# Altium schematic sheet EgSA-Cube3.SchDoc (part 2 of 3)
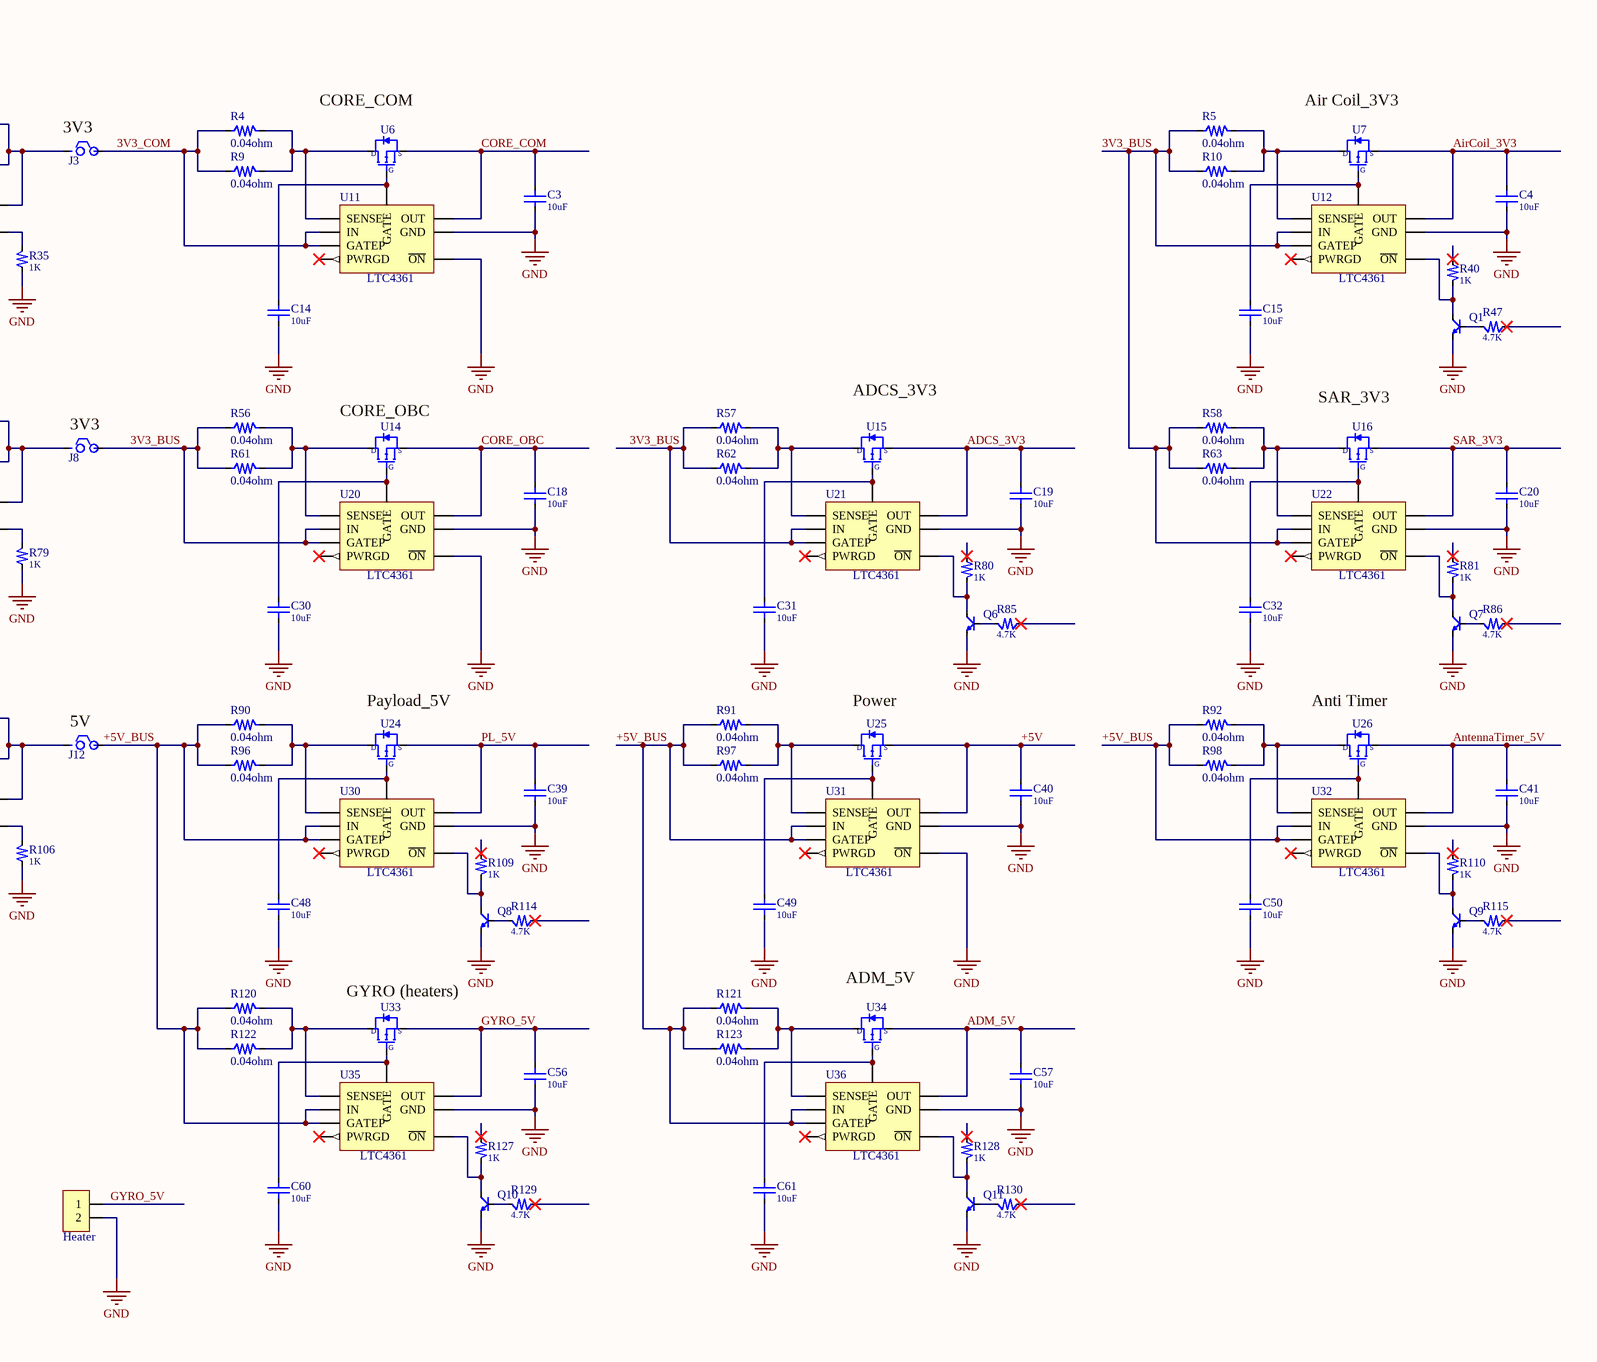
[diagram p4: EgSA-Cube3.SchDoc, bottom right]
## Library data of the parts
+X +Y +Z -X -Y Heater J_BAT J_SAR RBF1 RBF2 SSW1 = 53261-0271: CONN HEADER SMD R/A 2POS 1.25MM; Manufacturer: Molex, LLC; Manufacturer Part Number: 0532610271; Pitch - Mating: 0.049" (1.25mm); Number of Positions: 2; Number of Positions Loaded: All; Style: Board to Cable/Wire; Shrouding: Shrouded - 4 Wall; Material Flammability Rating: UL94 V-0; Mated Stacking Heights: 3.4mm; Supplier 1: Digi-Key; RoHS: RoHS Compliant; Category: Connectors, Interconnects; Stock 1: 17574; Pricing 1: 1=0.93, 10=0.819, 100=0.7066, 500=0.57816 (USD); Packaging: Cut Tape (CT); Part Status: Active; Connector Type: Header; Contact Type: Male Blade; Number of Rows: 1; Row Spacing - Mating: -; Mounting Type: Surface Mount, Right Angle; Termination: Solder; Fastening Type: Detent Lock; Contact Length - Mating: -; Contact Length - Post: -; Overall Contact Length: -; Insulation Height: 0.134" (3.40mm); Contact Shape: Rectangular; Contact Finish - Mating: Tin; Contact Finish Thickness - Mating: 39µin (1.00µm); Contact Finish - Post: Tin; Contact Material: Phosphor Bronze; Insulation Material: Polyamide (PA46), Nylon 4/6; Features: Solder Retention; Operating Temperature: -; Ingress Protection: -; Insulation Color: Natural; Current Rating: -; Voltage Rating: -; Contact Finish Thickness - Post: -; Applications: Automotive, General Purpose, Industrial, Medical; ComponentLink1URL: http://www.molex.com/pdm_docs/sd/532610271_sd.pdf; ComponentLink1Description: http://www.molex.com/pdm_docs/sd/532610271_sd.pdf; Supplier Part Number 1: WM7620CT-ND
BAT = 53261-0771: CONN HEADER SMD R/A 7POS 1.25MM; Manufacturer: Molex; Body Plating: Tin; Number of Contacts: 7; Contact Resistance: 20mR; Connector Type: Blade Pin; Current Rating: 1A; Voltage Rating: 125V; Insulation Resistance: 100MR; Supplier 1: Digi-Key; Supplier Part Number 1: WM7625CT-ND; Manufacturer Part Number: 53261-0771; Stock 1: 18897; Pricing 1: 1=0.79, 10=0.668, 100=0.5198 (USD); Mount: Surface Mount; Contact Plating: Tin; Contact Material: Bronze,Tin,Brass; Color: Natural; Housing Color: Natural; Housing Material: Nylon; Min Operating Temperature: -40°C; Max Operating Temperature: 85°C; Termination: Solder; Number of Rows: 1; Orientation: Right Angle; Packaging: Tape and Reel; Number of Positions: 7; Series: PicoBlade; Contact Type: Blade Pin; Contact Gender: Male; Voltage Rating (AC): 125V; Working Voltage: 125V; Length: 13.9mm; Pitch: 1.25mm; Lead Pitch: 1.25mm; Depth: 5.2mm; Radiation Hardening: No; Flammability Rating: UL94 V-0; RoHS Compliant: Yes; REACH SVHC: Unknown; ComponentLink1URL: http://www.molex.com/pdm_docs/sd/532610771_sd.pdf?src-supplier=Digi-Key; ComponentLink1Description: http://www.molex.com/pdm_docs/sd/532610771_sd.pdf?src-supplier=Digi-Key; ComponentLink2URL: https://www.molex.com/pdm_docs/sd/532610771_sd.pdf?src-supplier=Digi-Key; ComponentLink2Description: https://www.molex.com/pdm_docs/sd/532610771_sd.pdf?src-supplier=Digi-Key; ComponentLink3URL: http://uk.rs-online.com/webdocs/13c4/0900766b813c44c2.pdf?src-supplier=RSComponents; ComponentLink3Description: http://uk.rs-online.com/webdocs/13c4/0900766b813c44c2.pdf?src-supplier=RSComponents; ComponentLink4URL: http://www.farnell.com/datasheets/1867373.pdf?src-supplier=Element14; ComponentLink4Description: http://www.farnell.com/datasheets/1867373.pdf?src-supplier=Element14; ComponentLink5URL: http://www.jameco.com/Jameco/Products/ProdDS/1932571.pdf?src-supplier=Jameco; ComponentLink5Description: http://www.jameco.com/Jameco/Products/ProdDS/1932571.pdf?src-supplier=Jameco; ComponentLink6URL: http://www.farnell.com/cad/1768013.pdf?src-supplier=Farnell; ComponentLink6Description: http://www.farnell.com/cad/1768013.pdf?src-supplier=Farnell; ComponentLink7URL: http://www.molex.com/webdocs/datasheets/pdf/en-us/0532610771_PCB_HEADERS.pdf?src-supplier=Avnet; ComponentLink7Description: http://www.molex.com/webdocs/datasheets/pdf/en-us/0532610771_PCB_HEADERS.pdf?src-supplier=Avnet; ComponentLink8URL: http://www.farnell.com/datasheets/1801021.pdf?src-supplier=Element14; ComponentLink8Description: http://www.farnell.com/datasheets/1801021.pdf?src-supplier=Element14
C1 C2 C16 C17 C37 C38 = T591B476M010ATE070: CAP TANT POLY 47UF 10V 1411; Manufacturer: KEMET; Dielectric Material: Tantalum; ESR (Equivalent Series Resistance): 70mR; Tolerance: 20%; Leakage Current: 47uA; Dissipation Factor: 8%; Ripple Current: 1.347A; Life (Hours): 2000Hour; Lead Diameter: 0.2mm; Supplier 1: Digi-Key; Manufacturer Part Number: T591B476M010ATE070; Stock 1: 11764; Pricing 1: 1=1.21, 10=0.957, 50=0.8294, 100=0.7178, 500=0.5423, 1000=0.4785 (USD); Mount: Surface Mount; Case/Package: 1411; Weight: 0.002293oz; Case Code (Metric): 3528; Case Code (Imperial): 1311; Min Operating Temperature: -55°C; Max Operating Temperature: 125°C; Capacitance: 47uF; Voltage Rating: 10V; Packaging: Tape and Reel; Voltage Rating (DC): 10V; Voltage: 10V; Termination: SMD/SMT; Package Quantity: 2000; Features: General Purpose; Length: 3.5mm; Height: 1.9mm; Width: 0.11inch; Height - Seated (Max): 0.079inch; Lead Pitch: 1.1mm; Depth: 2.8mm; Radiation Hardening: No; REACH SVHC: No SVHC; ComponentLink1URL: https://www.distrelec.biz/Web/Downloads/_t/ds/T591-series_eng_tds.pdf?mime=application%2Fpdf&src-supplier=Distrelec; ComponentLink1Description: https://www.distrelec.biz/Web/Downloads/_t/ds/T591-series_eng_tds.pdf?mime=application%2Fpdf&src-supplier=Distrelec; ComponentLink2URL: http://www.alliedelec.com/images/products/datasheets/bm/KEMET/70428362.pdf?src-supplier=Allied+Electronics; ComponentLink2Description: http://www.alliedelec.com/images/products/datasheets/bm/KEMET/70428362.pdf?src-supplier=Allied+Electronics; Supplier Part Number 1: 399-11675-1-ND
C3 C4 C14 C15 C18-C20 C30-C32 C39-C41 C48-C50 C56 C57 C60 C61 = CL21B106KOQNNNE: CAP CER 10UF 16V X7R 0805; Manufacturer: Samsung Electro-Mechanics; Tolerance: ±10%; Notification: Current market demand for these product types have resulted in fluctuating and extending lead times. Lead times may differ.; Supplier 1: Digi-Key; Manufacturer Part Number: CL21B106KOQNNNE; RoHS: RoHS Compliant; Category: Capacitors; Stock 1: 25; Pricing 1: 1=0.34, 10=0.232, 100=0.1313, 500=0.0927, 1000=0.08111 (USD); Packaging: Cut Tape (CT); Part Status: Active; Voltage - Rated: 16V; Temperature Coefficient: X7R; Operating Temperature: -55°C ~ 125°C; Features: -; Ratings: -; Applications: General Purpose; Mounting Type: Surface Mount, MLCC; Package / Case: 0805 (2012 Metric); Size / Dimension: 0.079" L x 0.049" W (2.00mm x 1.25mm); Height - Seated (Max): -; Thickness (Max): 0.055" (1.40mm); Lead Spacing: -; Lead Style: -; ComponentLink1URL: http://www.samsungsem.com/kr/support/product-search/mlcc/CL21B106KOQNNNE.jsp; ComponentLink1Description: http://www.samsungsem.com/kr/support/product-search/mlcc/CL21B106KOQNNNE.jsp; Supplier Part Number 1: 1276-2872-1-ND
C5 C21 C42 C52 = CL21B105KAFVPNE: CAP CER 1UF 25V X7R 0805; Manufacturer: Samsung; Tolerance: 10%; Supplier 1: Digi-Key; Supplier Part Number 1: 1276-6822-1-ND; Manufacturer Part Number: CL21B105KAFVPNE; Stock 1: 27657; Pricing 1: 1=0.18, 10=0.124, 50=0.0742, 100=0.0627, 500=0.0429, 1000=0.038 (USD); Mount: Surface Mount; Case/Package: 0805; Case Code (Metric): 2012; Case Code (Imperial): 0805; Min Operating Temperature: -55°C; Max Operating Temperature: 125°C; Capacitance: 1uF; Packaging: Tape and Reel; Dielectric: X7R; Voltage Rating: 25V; Features: Soft Termination; Length: 0.079inch; Width: 0.049inch; Thickness: 0.053inch; Depth: 1.25mm; Ratings: AEC-Q200; RoHS Compliant: Yes; ComponentLink1URL: http://www.samsungsem.com/kr/support/library/product-catalog/mlcc.jsp?src-supplier=Digi-Key; ComponentLink1Description: http://www.samsungsem.com/kr/support/library/product-catalog/mlcc.jsp?src-supplier=Digi-Key; ComponentLink2URL: http://www.samsungsem.com/kr/support/product-search/mlcc/CL21B105KAFVPNE.jsp?src-supplier=Digi-Key; ComponentLink2Description: http://www.samsungsem.com/kr/support/product-search/mlcc/CL21B105KAFVPNE.jsp?src-supplier=Digi-Key; ComponentLink3URL: http://www.samsungsem.com/servlet/FileDownload?type=spec&file=CL21B105KAFVPNE.pdf&src-supplier=Avnet; ComponentLink3Description: http://www.samsungsem.com/servlet/FileDownload?type=spec&file=CL21B105KAFVPNE.pdf&src-supplier=Avnet; ComponentLink4URL: http://components.arrow.com/part/dataview/0323_06933351?src-supplier=Arrow+Europe; ComponentLink4Description: http://components.arrow.com/part/dataview/0323_06933351?src-supplier=Arrow+Europe
C6 C7 C22 C23 C36 C43 C44 = T520B107M006ATE018: CAP TANT POLY 100UF 6.3V 1411; Manufacturer: KEMET; Dielectric Material: Tantalum; Tolerance: 20%; ESR (Equivalent Series Resistance): 18mR; Resistance: 0.018R; Polarity: Polar; Life (Hours): 2000Hour; Dissipation Factor: 8%; Supplier 1: Digi-Key; Supplier Part Number 1: 399-5308-1-ND; Manufacturer Part Number: T520B107M006ATE018; Stock 1: 11293; Pricing 1: 1=1.19, 10=0.939, 50=0.8136, 100=0.704, 500=0.5319, 1000=0.4694 (USD); Mount: Surface Mount; Case/Package: 1411; Number of Pins: 2; Case Code (Metric): 3528; Case Code (Imperial): 1411; Min Operating Temperature: -55°C; Max Operating Temperature: 105°C; Package Quantity: 1; Capacitance: 100uF; Voltage Rating: 6.3V; Packaging: Tape and Reel; Voltage Rating (DC): 6.3V; Termination: SMD/SMT; Features: General Purpose; Series: KO-CAP T520; Construction: Flat; Length: 3.5mm; Width: 0.11inch; Height: 2.1mm; Height - Seated (Max): 0.083inch; Depth: 2.8mm; Radiation Hardening: No; REACH SVHC: No SVHC; RoHS Compliant: Yes; ComponentLink1URL: https://search.kemet.com/component-edge/download/datasheet/T520B107M006ATE018.pdf?src-supplier=Digi-Key; ComponentLink1Description: https://search.kemet.com/component-edge/download/datasheet/T520B107M006ATE018.pdf?src-supplier=Digi-Key; ComponentLink2URL: http://www.farnell.com/datasheets/1759375.pdf?src-supplier=Element14; ComponentLink2Description: http://www.farnell.com/datasheets/1759375.pdf?src-supplier=Element14; ComponentLink3URL: https://content.kemet.com/datasheets/KEM_T2076_T52X-530.pdf?src-supplier=Digi-Key; ComponentLink3Description: https://content.kemet.com/datasheets/KEM_T2076_T52X-530.pdf?src-supplier=Digi-Key
C8 C24 C45 = 0805YC474KAT2A: CAP CER 0.47UF 16V X7R 0805; Manufacturer: Kyocera AVX; Tolerance: 10%; Capacitance: 470nF; Insulation Resistance: 100GR; Dissipation Factor: 3.5%; Supplier 1: Digi-Key; Supplier Part Number 1: 478-1403-1-ND; Manufacturer Part Number: 0805YC474KAT2A; Stock 1: 215925; Pricing 1: 1=0.28, 10=0.191, 50=0.1144, 100=0.0966, 500=0.0661, 1000=0.0584 (USD); Mount: Surface Mount,PCB; Case/Package: 0805; Number of Pins: 2; Case Code (Imperial): 0805; Case Code (Metric): 2012; Contact Plating: Tin,Matte; Min Operating Temperature: -55°C; Max Operating Temperature: 125°C; Dielectric: X7R; Packaging: Tape and Reel; Voltage Rating (DC): 16V; Voltage: 16V; Voltage Rating: 16V; Package Quantity: 1; Termination: SMD/SMT; Length: 2.01mm; Height: 1.4mm; Depth: 1.25mm; Width: 1.25mm; Thickness: 0.055inch; Radiation Hardening: No; REACH SVHC: No SVHC; Lead Free: Lead Free; ComponentLink1URL: http://uk.rs-online.com/webdocs/0ed4/0900766b80ed4be2.pdf?src-supplier=RSComponents; ComponentLink1Description: http://uk.rs-online.com/webdocs/0ed4/0900766b80ed4be2.pdf?src-supplier=RSComponents; ComponentLink2URL: http://www.mouser.com/ds/2/40/X7RDielectric-777024.pdf?src-supplier=Mouser; ComponentLink2Description: http://www.mouser.com/ds/2/40/X7RDielectric-777024.pdf?src-supplier=Mouser; ComponentLink3URL: https://www.alliedelec.com/m/d/a24bb5190bea413b2ff164816f55e87c.pdf?src-supplier=Allied+Electronics; ComponentLink3Description: https://www.alliedelec.com/m/d/a24bb5190bea413b2ff164816f55e87c.pdf?src-supplier=Allied+Electronics; ComponentLink4URL: http://www.avx.com/docs/Catalogs/cx7r.pdf?src-supplier=Future+Electronics; ComponentLink4Description: http://www.avx.com/docs/Catalogs/cx7r.pdf?src-supplier=Future+Electronics; ComponentLink5URL: http://www.jameco.com/Jameco/Products/ProdDS/2011221.pdf?src-supplier=Jameco; ComponentLink5Description: http://www.jameco.com/Jameco/Products/ProdDS/2011221.pdf?src-supplier=Jameco; ComponentLink6URL: http://www.avx.com/docs/catalogs/cx7r.pdf?src-supplier=Avnet+Europe; ComponentLink6Description: http://www.avx.com/docs/catalogs/cx7r.pdf?src-supplier=Avnet+Europe; ComponentLink7URL: http://www.avx.com/docs/catalogs/cx7r.pdf?src-supplier=Avnet; ComponentLink7Description: http://www.avx.com/docs/catalogs/cx7r.pdf?src-supplier=Avnet; ComponentLink8URL: http://catalogs.avx.com/SurfaceMount.pdf?src-supplier=Digi-Key; ComponentLink8Description: http://catalogs.avx.com/SurfaceMount.pdf?src-supplier=Digi-Key; ComponentLink9URL: http://datasheets.avx.com/AutoMLCC.pdf?src-supplier=Avnet+Asia; ComponentLink9Description: http://datasheets.avx.com/AutoMLCC.pdf?src-supplier=Avnet+Asia; ComponentLink10URL: http://datasheets.avx.com/X7RDielectric.pdf?src-supplier=Digi-Key; ComponentLink10Description: http://datasheets.avx.com/X7RDielectric.pdf?src-supplier=Digi-Key; ComponentLink11URL: http://avx.com/docs/Catalogs/cx7r.pdf?src-supplier=Element14; ComponentLink11Description: http://avx.com/docs/Catalogs/cx7r.pdf?src-supplier=Element14
C9 C10 C25 C26 C53 = CGA4J1X7R1V475K125AC: CAP CER 4.7UF 35V X7R 0805; Manufacturer: TDK; Tolerance: 10%; Supplier 1: Digi-Key; Supplier Part Number 1: 445-175363-1-ND; Manufacturer Part Number: CGA4J1X7R1V475K125AC; Stock 1: 20312; Pricing 1: 1=0.48, 10=0.338, 50=0.2558, 100=0.2228, 500=0.165, 1000=0.1403 (USD); Mount: Surface Mount; Case/Package: 0805; Case Code (Imperial): 0805; Case Code (Metric): 2012; Weight: 0.000194oz; Min Operating Temperature: -55°C; Max Operating Temperature: 125°C; Capacitance: 4.7uF; Packaging: Tape and Reel; Voltage Rating: 35V; Dielectric: X7R; Termination: SMD/SMT; Voltage Rating (DC): 35V; Package Quantity: 2000; Length: 0.079inch; Width: 0.049inch; Height: 1.25mm; Thickness: 0.057inch; Ratings: AEC-Q200; Lead Free: Lead Free; RoHS Compliant: Yes; ComponentLink1URL: https://product.tdk.com/info/en/catalog/datasheets/mlcc_automotive_general_en.pdf?src-supplier=Digi-Key; ComponentLink1Description: https://product.tdk.com/info/en/catalog/datasheets/mlcc_automotive_general_en.pdf?src-supplier=Digi-Key; ComponentLink2URL: https://product.tdk.com/info/en/catalog/spec/mlccspec_automotive_general_midvoltage_en.pdf?src-supplier=Digi-Key; ComponentLink2Description: https://product.tdk.com/info/en/catalog/spec/mlccspec_automotive_general_midvoltage_en.pdf?src-supplier=Digi-Key; ComponentLink3URL: http://product.tdk.com/capacitor/mlcc/class/print_detail_pdf.php?lang=en&part_no=CGA4J1X7R1V475K125AC&src-supplier=Avnet; ComponentLink3Description: http://product.tdk.com/capacitor/mlcc/class/print_detail_pdf.php?lang=en&part_no=CGA4J1X7R1V475K125AC&src-supplier=Avnet; ComponentLink4URL: http://product.tdk.com/capacitor/mlcc/detailed_information.php?lang=en&ref=jp&part_no=CGA4J1X7R1V475K125AC&src-supplier=Mouser; ComponentLink4Description: http://product.tdk.com/capacitor/mlcc/detailed_information.php?lang=en&ref=jp&part_no=CGA4J1X7R1V475K125AC&src-supplier=Mouser
C11 C12 C27 C28 C46 C47 = C2012X5R1C226M125AC: CAP CER 22UF 16V X5R 0805; Manufacturer: TDK; Dielectric Material: Ceramic; Tolerance: 20%; Supplier 1: Digi-Key; Supplier Part Number 1: 445-7647-1-ND; Manufacturer Part Number: C2012X5R1C226M125AC; Stock 1: 122957; Pricing 1: 1=0.64, 10=0.451, 50=0.341, 100=0.297, 500=0.22, 1000=0.187 (USD); Mount: Surface Mount; Case/Package: 0805; Number of Pins: 2; Case Code (Metric): 2012; Case Code (Imperial): 0805; Weight: 0.000194oz; Min Operating Temperature: -55°C; Max Operating Temperature: 85°C; Capacitance: 22uF; Dielectric: X5R; Packaging: Tape and Reel; Voltage Rating: 16V; Voltage Rating (DC): 16V; Termination: SMD/SMT; Package Quantity: 1; Resistor Type: Ceramic; Series: C; Construction: Flat; Length: 2mm; Width: 0.049inch; Height: 1.25mm; Depth: 1.25mm; Thickness: 0.057inch; Radiation Hardening: No; Lead Free: Lead Free; REACH SVHC: Unknown; RoHS Compliant: Yes; ComponentLink1URL: https://product.tdk.com/info/en/documents/chara_sheet/C2012X5R1C226M125AC.pdf?src-supplier=Digi-Key; ComponentLink1Description: https://product.tdk.com/info/en/documents/chara_sheet/C2012X5R1C226M125AC.pdf?src-supplier=Digi-Key; ComponentLink2URL: http://www.farnell.com/datasheets/1913358.pdf?src-supplier=Element14; ComponentLink2Description: http://www.farnell.com/datasheets/1913358.pdf?src-supplier=Element14; ComponentLink3URL: http://www.tdk.co.jp/tefe02/e412_c.pdf?src-supplier=Future+Electronics; ComponentLink3Description: http://www.tdk.co.jp/tefe02/e412_c.pdf?src-supplier=Future+Electronics
C13 C29 = VJ0805Y222KXACW1BC: CAP CER 2200PF 50V X7R 0805; Manufacturer: Vishay; Capacitance: 2.2nF; Tolerance: 10%; Supplier 1: Digi-Key; Supplier Part Number 1: 720-1604-1-ND; Manufacturer Part Number: VJ0805Y222KXACW1BC; Stock 1: 13835; Pricing 1: 1=0.25, 10=0.17, 50=0.1022, 100=0.0862, 500=0.059, 1000=0.0522 (USD); Mount: Surface Mount; Case/Package: 0805; Case Code (Metric): 2012; Case Code (Imperial): 0805; Weight: 0.000194oz; Min Operating Temperature: -55°C; Max Operating Temperature: 125°C; Dielectric: X7R; Voltage Rating: 50V; Package Quantity: 4000; Packaging: Tape and Reel; Voltage Rating (DC): 50V; Termination: SMD/SMT; Series: VJ; Construction: Flat; Length: 2mm; Width: 0.049inch; Height: 1.45mm; Depth: 1.25mm; Thickness: 0.037inch; Radiation Hardening: No; RoHS Compliant: Yes; ComponentLink1URL: http://www.vishay.com/docs/28548/vjw1bcbascomseries.pdf?src-supplier=Digi-Key; ComponentLink1Description: http://www.vishay.com/docs/28548/vjw1bcbascomseries.pdf?src-supplier=Digi-Key; ComponentLink2URL: http://www.mouser.com/ds/2/427/vjw1bcbascomseries-223529.pdf?src-supplier=Mouser; ComponentLink2Description: http://www.mouser.com/ds/2/427/vjw1bcbascomseries-223529.pdf?src-supplier=Mouser; ComponentLink3URL: http://www.vishay.com/docs/28548/vjw1bcbascomseries.pdf?src-supplier=Avnet+Europe; ComponentLink3Description: http://www.vishay.com/docs/28548/vjw1bcbascomseries.pdf?src-supplier=Avnet+Europe
C33-C35 C58 C59 = C0805C104J4RACTU: CAP CER 0.1UF 16V X7R 0805; Manufacturer: KEMET; Tolerance: ±5%; Notification: Current market demand for these product types have resulted in fluctuating and extending lead times. Lead times may differ.; Supplier 1: Digi-Key; Manufacturer Part Number: C0805C104J4RACTU; RoHS: RoHS Compliant; Category: Capacitors; Stock 1: 1390; Pricing 1: 1=0.6, 10=0.424, 100=0.2795, 500=0.207, 1000=0.17595 (USD); Packaging: Cut Tape (CT); Part Status: Active; Voltage - Rated: 16V; Temperature Coefficient: X7R; Operating Temperature: -55°C ~ 125°C; Features: Low ESL; Ratings: -; Applications: General Purpose; Failure Rate: -; Mounting Type: Surface Mount, MLCC; Package / Case: 0805 (2012 Metric); Size / Dimension: 0.079" L x 0.049" W (2.00mm x 1.25mm); Height - Seated (Max): -; Thickness (Max): 0.035" (0.88mm); Lead Spacing: -; Lead Style: -; ComponentLink1URL: https://search.kemet.com/component-edge/download/datasheet/C0805C104J4RACTU.pdf; ComponentLink1Description: https://search.kemet.com/component-edge/download/datasheet/C0805C104J4RACTU.pdf; Supplier Part Number 1: 399-11163-1-ND
C51 = C2012X5R1A476M125AC: CAP CER 47UF 10V X5R 0805; Manufacturer: TDK; Dielectric Material: Ceramic; Tolerance: 20%; Supplier 1: Digi-Key; Supplier Part Number 1: 445-8239-1-ND; Manufacturer Part Number: C2012X5R1A476M125AC; Stock 1: 142188; Pricing 1: 1=0.85, 10=0.644, 50=0.5346, 100=0.4604, 500=0.3564, 1000=0.3069 (USD); Mount: Surface Mount; Case/Package: 0805; Case Code (Metric): 2012; Case Code (Imperial): 0805; Weight: 0.000194oz; Min Operating Temperature: -55°C; Max Operating Temperature: 85°C; Capacitance: 47uF; Voltage Rating: 10V; Packaging: Tape and Reel; Voltage Rating (DC): 10V; Dielectric: X5R; Termination: SMD/SMT; Package Quantity: 1; Resistor Type: Ceramic; Voltage: 10V; Series: C; Length: 2mm; Width: 0.049inch; Height: 1.25mm; Depth: 1.25mm; Thickness: 0.057inch; REACH SVHC: No SVHC; Lead Free: Lead Free; RoHS Compliant: Yes; ComponentLink1URL: https://product.tdk.com/info/en/documents/chara_sheet/C2012X5R1A476M125AC.pdf?src-supplier=Digi-Key; ComponentLink1Description: https://product.tdk.com/info/en/documents/chara_sheet/C2012X5R1A476M125AC.pdf?src-supplier=Digi-Key; ComponentLink2URL: http://www.mouser.com/ds/2/400/lcc_commercial_general_en-837201.pdf?src-supplier=Mouser; ComponentLink2Description: http://www.mouser.com/ds/2/400/lcc_commercial_general_en-837201.pdf?src-supplier=Mouser; ComponentLink3URL: http://www.farnell.com/datasheets/1796654.pdf?src-supplier=Element14; ComponentLink3Description: http://www.farnell.com/datasheets/1796654.pdf?src-supplier=Element14; ComponentLink4URL: http://www1.futureelectronics.com/doc/TDK/C2012X5R1A476M125AC.pdf?src-supplier=Future+Electronics; ComponentLink4Description: http://www1.futureelectronics.com/doc/TDK/C2012X5R1A476M125AC.pdf?src-supplier=Future+Electronics
C54 = VJ0805Y681JXXCW1BC: CAP CER 680PF 25V X7R 0805; Manufacturer: Vishay Vitramon; Dielectric Material: Tantalum; Tolerance: 5%; Supplier 1: Mouser; Supplier Part Number 1: 77-VJ0805Y681JXXCBC; Manufacturer Part Number: VJ0805Y681JXXCW1BC; Stock 1: 9511; Pricing 1: 1=0.41, 10=0.41, 50=0.149, 100=0.121, 1000=0.07, 10000=0.061 (USD); Mount: Surface Mount; Case/Package: 0805; Case Code (Imperial): 0805; Case Code (Metric): 2012; Weight: 0.000194oz; Min Operating Temperature: -55°C; Max Operating Temperature: 125°C; Capacitance: 680pF; Package Quantity: 4000; Packaging: Tape and Reel; Dielectric: X7R; Voltage Rating (DC): 25V; Termination: SMD/SMT; Series: VJ W1BC; Construction: Flat; Length: 2mm; Width: 1.25mm; Height: 1.45mm; Depth: 1.25mm; Lead Free: Lead Free; RoHS Compliant: Yes; ComponentLink1URL: http://www.vishay.com/docs/28548/vjw1bcbascomseries.pdf?src-supplier=Avnet; ComponentLink1Description: http://www.vishay.com/docs/28548/vjw1bcbascomseries.pdf?src-supplier=Avnet
C55 = C0805C472K4RAC7800: CAP CER 4700PF 16V X7R 0805; Manufacturer: KEMET; Dielectric Material: Ceramic; Capacitance: 4.7nF; Tolerance: 10%; Supplier 1: Digi-Key; Supplier Part Number 1: 399-14607-1-ND; Manufacturer Part Number: C0805C472K4RAC7800; Stock 1: 904; Pricing 1: 1=0.3, 10=0.207, 50=0.1378, 100=0.1171, 500=0.0826, 1000=0.0723 (USD); Mount: Surface Mount; Case/Package: 0805; Min Operating Temperature: -55°C; Max Operating Temperature: 125°C; Dielectric: X7R; Packaging: Tape and Reel; Voltage Rating (DC): 16V; Construction: Flat; Length: 2mm; Height: 0.78mm; Depth: 1.25mm; Radiation Hardening: No; ComponentLink1URL: http://components.arrow.com/part/dataview/0323_00331522?src-supplier=Arrow+Europe; ComponentLink1Description: http://components.arrow.com/part/dataview/0323_00331522?src-supplier=Arrow+Europe; ComponentLink2URL: http://capacitoredge.kemet.com/capedge2/DataSheet?pn=C0805C472K4RACTU&src-supplier=Avnet+Europe; ComponentLink2Description: http://capacitoredge.kemet.com/capedge2/DataSheet?pn=C0805C472K4RACTU&src-supplier=Avnet+Europe
D1 D2 D5-D8 = SL22PL-TP: DIODE SCHOTTKY 20V 2A SOD-123FL; Manufacturer: MCC; Supplier 1: Digi-Key; Supplier Part Number 1: SL22PL-TPMSCT-ND; Manufacturer Part Number: SL22PL-TP; Stock 1: 196; Pricing 1: 1=0.39, 10=0.293, 25=0.264, 100=0.1392, 250=0.1378, 500=0.1234, 1000=0.096 (USD); ComponentLink1URL: https://www.mccsemi.com/pdf/Products/SL22PL(SOD-123FL)-B.pdf?src-supplier=Digi-Key; ComponentLink1Description: https://www.mccsemi.com/pdf/Products/SL22PL(SOD-123FL)-B.pdf?src-supplier=Digi-Key
D3 D4 = MMSD459A: DIODE GEN PURP SOD123; Manufacturer: ON Semiconductor; Diode Type: Standard; Speed: Standard Recovery >500ns, > 200mA (Io); Supplier 1: Digi-Key; Manufacturer Part Number: MMSD459A; RoHS: RoHS Compliant; Category: Discrete Semiconductor Products; Stock 1: 0; Pricing 1: 1=0 (USD); Packaging: Digi-Reel®; Part Status: Discontinued at Digi-Key; Current - Average Rectified (Io): -; Capacitance @ Vr, F: -; Mounting Type: Surface Mount; Package / Case: SOD-123; Supplier Device Package: SOD-123; Operating Temperature - Junction: 150°C (Max); Base Part Number: MMSD459; Supplier Part Number 1: MMSD459ADKR-ND
F1 = 1206L500/12SLPR: PTC RESET FUSE 5.0A 12V 1206; Manufacturer: Littelfuse; Supplier 1: Mouser; Supplier Part Number 1: 576-1206L500/12SLPR; Manufacturer Part Number: 1206L500/12SLPR; Stock 1: 2000; Pricing 1: 1=1.95, 10=1.85, 25=1.49, 100=1.27, 250=1.23, 500=1.04 (USD)
J1 J2 J5 J7 J11 J17 = JUMPER: OPTION SELECTION 2POS PAD; Supplier 1: Digi-Key
J3 J8 J12 = ESW-102-13-L-S: CONN SOCKET 2POS 0.1 GOLD PCB; Manufacturer: Samtec; Supplier 1: Digi-Key; Supplier Part Number 1: ESW-102-13-L-S-ND; Manufacturer Part Number: ESW-102-13-L-S; Stock 1: 187; Pricing 1: 1=0.87, 10=0.765, 100=0.66, 500=0.54, 1000=0.48, 5000=0.42, 10000=0.399 (USD); ComponentLink1URL: http://www.farnell.com/datasheets/2607183.pdf?src-supplier=Farnell; ComponentLink1Description: http://www.farnell.com/datasheets/2607183.pdf?src-supplier=Farnell; RoHS Compliant: Yes
J14 = ESQ-126-13-L-D: CONN SOCKET 52POS 0.1 GOLD PCB; Manufacturer: Samtec; Gender: Receptacle; Number of Contacts: 52; Pitch: 2.54mm; Supplier 1: Digi-Key; Supplier Part Number 1: ESQ-126-13-L-D-ND; Manufacturer Part Number: ESQ-126-13-L-D; Stock 1: 11; Pricing 1: 1=8.21 (USD); Mount: Through Hole; Contact Plating: Gold; Contact Material: Bronze; Number of Rows: 2; Packaging: Bulk; Termination: Solder; Radiation Hardening: No; REACH SVHC: No SVHC; ComponentLink1URL: http://www.farnell.com/datasheets/1992053.pdf?src-supplier=Farnell; ComponentLink1Description: http://www.farnell.com/datasheets/1992053.pdf?src-supplier=Farnell; ComponentLink2URL: http://cloud.samtec.com/catalog_english/ESW_TH.PDF?src-supplier=Avnet; ComponentLink2Description: http://cloud.samtec.com/catalog_english/ESW_TH.PDF?src-supplier=Avnet
J19 = ESQ-120-13-L-D: CONN SOCKET 40POS 0.1 GOLD PCB
J_Antenna Temp = 53261-0471: CONN HEADER SMD R/A 4POS 1.25MM; Manufacturer: Molex; Number of Positions: 4; Gender: Male; Contact Resistance: 20mR; Current Rating: 1A; Voltage Rating (AC): 125V; Insulation Resistance: 100MR; Glow Wire Compliant: Non-compliant; Supplier 1: Digi-Key; Supplier Part Number 1: WM7622CT-ND; Manufacturer Part Number: 53261-0471; Stock 1: 35326; Pricing 1: 1=0.59, 10=0.499, 100=0.3883 (USD); Mount: Surface Mount; Contact Plating: Tin; Contact Material: Tin; Color: Beige; Housing Material: Thermoplastic; Housing Color: Natural; Weight: 0.005598oz; Min Operating Temperature: -40°C; Max Operating Temperature: 105°C; Termination: SMD/SMT; Number of Rows: 1; Packaging: Cut Tape; Number of Contacts: 4; Orientation: Right Angle; Series: 53261; Package Quantity: 1000; Contact Type: -; Number of Circuits: 4; Voltage Rating: 125V; Working Voltage: 125V; Voltage Rating (DC): 125V; Contact Gender: Male; Pitch: 1.25mm; Lead Pitch: 1.25mm; Radiation Hardening: No; RoHS Compliant: Yes; Lead Free: Lead Free; Flammability Rating: UL94 V-0; REACH SVHC: Unknown; ComponentLink1URL: http://www.mouser.com/ds/2/276/0532610471_PCB_HEADERS-170942.pdf?src-supplier=Mouser; ComponentLink1Description: http://www.mouser.com/ds/2/276/0532610471_PCB_HEADERS-170942.pdf?src-supplier=Mouser; ComponentLink2URL: http://components.arrow.com/part/dataview/41622439S9851324N3303?src-supplier=Arrow+Electronics; ComponentLink2Description: http://components.arrow.com/part/dataview/41622439S9851324N3303?src-supplier=Arrow+Electronics; ComponentLink3URL: http://uk.rs-online.com/webdocs/1380/0900766b8138010d.pdf?src-supplier=RSComponents; ComponentLink3Description: http://uk.rs-online.com/webdocs/1380/0900766b8138010d.pdf?src-supplier=RSComponents; ComponentLink4URL: http://www.farnell.com/datasheets/1867384.pdf?src-supplier=Element14; ComponentLink4Description: http://www.farnell.com/datasheets/1867384.pdf?src-supplier=Element14; ComponentLink5URL: http://www.molex.com/webdocs/datasheets/pdf/en-us/0532610471_PCB_HEADERS.pdf?src-supplier=Avnet+Europe; ComponentLink5Description: http://www.molex.com/webdocs/datasheets/pdf/en-us/0532610471_PCB_HEADERS.pdf?src-supplier=Avnet+Europe; ComponentLink6URL: http://www.molex.com/webdocs/datasheets/pdf/en-us/0532610471_PCB_HEADERS.pdf?src-supplier=Avnet; ComponentLink6Description: http://www.molex.com/webdocs/datasheets/pdf/en-us/0532610471_PCB_HEADERS.pdf?src-supplier=Avnet; ComponentLink7URL: http://www.farnell.com/datasheets/2697767.pdf?src-supplier=Newark; ComponentLink7Description: http://www.farnell.com/datasheets/2697767.pdf?src-supplier=Newark; ComponentLink8URL: https://www.alliedelec.com/m/d/74d14d19c60ab078e4881c4c1bd42ef7.pdf?src-supplier=Allied+Electronics; ComponentLink8Description: https://www.alliedelec.com/m/d/74d14d19c60ab078e4881c4c1bd42ef7.pdf?src-supplier=Allied+Electronics; ComponentLink9URL: http://www.jameco.com/Jameco/Products/ProdDS/1932555.pdf?src-supplier=Jameco; ComponentLink9Description: http://www.jameco.com/Jameco/Products/ProdDS/1932555.pdf?src-supplier=Jameco
L1 L2 = XEL4020-152MEB: FIXED IND 1.5UH 7.5A 23.6 MOHM; Manufacturer: Coilcraft; Supplier 1: Mouser; Supplier Part Number 1: 994-XEL4020-152MEB; Manufacturer Part Number: XEL4020-152MEB; Stock 1: 500; Pricing 1: 1=1.84, 10=1.65, 50=1.48, 100=1.32, 1000=0.956, 10000=0.89 (USD); RoHS Compliant: Yes
L3 = XEL4030-332MEC: FIXED IND 3.3UH 6.6A 28.6 MOHM; Manufacturer: Coilcraft; Supplier 1: Mouser; Supplier Part Number 1: 994-XEL4030-332MEC; Manufacturer Part Number: XEL4030-332MEC; Stock 1: 4395; Pricing 1: 1=2.21, 10=1.97, 50=1.77, 100=1.58, 1000=1.14, 10000=1.06 (USD)
Q1 Q4-Q11 = SMMBT3904LT3G: TRANS NPN 40V 0.2A SOT23; Manufacturer: ON Semiconductor; Vce Saturation (Max) @ Ib, Ic: 300mV @ 5mA, 50mA; DC Current Gain (hFE) (Min) @ Ic, Vce: 100 @ 10mA, 1V; Frequency - Transition: 300MHz; Supplier 1: Digi-Key; Manufacturer Part Number: SMMBT3904LT3G; RoHS: RoHS Compliant; Category: Discrete Semiconductor Products; Stock 1: 4146; Pricing 1: 1=0.31, 10=0.256, 100=0.1356, 500=0.08922, 1000=0.06067 (USD); Packaging: Cut Tape (CT); Part Status: Active; Transistor Type: NPN; Current - Collector Cutoff (Max): -; Operating Temperature: -55°C ~ 150°C (TJ); Mounting Type: Surface Mount; Package / Case: TO-236-3, SC-59, SOT-23-3; Supplier Device Package: SOT-23-3 (TO-236); ComponentLink1URL: http://www.onsemi.com/pub/Collateral/MMBT3904LT1-D.PDF; ComponentLink1Description: http://www.onsemi.com/pub/Collateral/MMBT3904LT1-D.PDF; Supplier Part Number 1: SMMBT3904LT3GOSCT-ND
Q2 Q3 = CMPT404A TR: Bipolar Transistors - BJT PNP Silicon Chopper SMT Transistor; Manufacturer: Central Semiconductor; hFE Min: 100; Max Power Dissipation: 350mW; Collector Base Voltage (VCBO): 40V; Collector Emitter Voltage (VCEO): 35V; Emitter Base Voltage (VEBO): 25V; Collector Emitter Saturation Voltage: 200mV; Continuous Collector Current: 150mA; Element Configuration: Single; Supplier 1: Mouser; Supplier Part Number 1: 610-CMPT404A-TR; Manufacturer Part Number: CMPT404A TR; Stock 1: 0; Case/Package: SOT-23; Min Operating Temperature: -65°C; Max Operating Temperature: 150°C; Packaging: Tape and Reel; Package Quantity: 3000; Polarity: PNP; Lead Free: Lead Free; ComponentLink1URL: http://www.mouser.com/ds/2/68/cmpt404a_r1-258738.pdf?src-supplier=Mouser; ComponentLink1Description: http://www.mouser.com/ds/2/68/cmpt404a_r1-258738.pdf?src-supplier=Mouser; ComponentLink2URL: http://www.centralsemi.com/PDFs/products/CMPT404A_R1.PDF?src-supplier=Future+Electronics; ComponentLink2Description: http://www.centralsemi.com/PDFs/products/CMPT404A_R1.PDF?src-supplier=Future+Electronics; ComponentLink3URL: http://datasheet.octopart.com/CMPT404A-TR-Central-Semiconductor-datasheet-527503.pdf?src-supplier=Future+Electronics; ComponentLink3Description: http://datasheet.octopart.com/CMPT404A-TR-Central-Semiconductor-datasheet-527503.pdf?src-supplier=Future+Electronics; ComponentLink4URL: http://datasheet.octopart.com/CMPT404A-TR-Central-Semiconductor-datasheet-13529226.pdf?src-supplier=Future+Electronics; ComponentLink4Description: http://datasheet.octopart.com/CMPT404A-TR-Central-Semiconductor-datasheet-13529226.pdf?src-supplier=Future+Electronics
R1 = ERJ-P6WJ102V: RES SMD 1K OHM 5% 1/2W 0805; Manufacturer: Panasonic Electronic Components; Power (Watts): 0.5W, 1/2W; Temperature Coefficient: ±200ppm/°C; Supplier 1: Digi-Key; Manufacturer Part Number: ERJ-P6WJ102V; RoHS: RoHS Compliant; Category: Resistors; Stock 1: 577; Pricing 1: 1=0.48, 10=0.365, 100=0.1534, 1000=0.08461, 2500=0.07933 (USD); Packaging: Cut Tape (CT); Part Status: Active; Tolerance: ±5%; Composition: Thick Film; Features: Automotive AEC-Q200, Pulse Withstanding; Operating Temperature: -55°C ~ 155°C; Package / Case: 0805 (2012 Metric); Supplier Device Package: 0805; Size / Dimension: 0.079" L x 0.049" W (2.00mm x 1.25mm); Height - Seated (Max): 0.030" (0.75mm); Failure Rate: -; ComponentLink1URL: https://industrial.panasonic.com/cdbs/www-data/pdf/RDO0000/AOA0000C331.pdf; ComponentLink1Description: https://industrial.panasonic.com/cdbs/www-data/pdf/RDO0000/AOA0000C331.pdf; Supplier Part Number 1: P16954CT-ND
R2-R7 R9 R10 R55-R59 R61-R63 R87-R92 R94 R96-R98 R120-R123 = RL3720WT-R040-G: RES 0.04 OHM 1W 1508 WIDE; Manufacturer: Susumu; Tolerance: ±2%; Temperature Coefficient: 0/ +350ppm/°C; Supplier 1: Digi-Key; Manufacturer Part Number: RL3720WT-R040-G; RoHS: RoHS Compliant; Category: Resistors; Stock 1: 2144; Pricing 1: 1=0.56, 10=0.469, 25=0.402, 50=0.3618, 100=0.3149, 250=0.28136, 500=0.22776, 1000=0.18422 (USD); Packaging: Cut Tape (CT); Part Status: Active; Power (Watts): 1W; Composition: Thin Film; Features: Current Sense; Operating Temperature: -55°C ~ 125°C; Package / Case: Wide 1508 (3720 Metric), 0815; Supplier Device Package: 0815; Size / Dimension: 0.079" L x 0.148" W (2.00mm x 3.75mm); Height - Seated (Max): 0.028" (0.70mm); Failure Rate: -; ComponentLink1URL: http://www.susumu.co.jp/common/pdf/n_catalog_partition07_en.pdf; ComponentLink1Description: http://www.susumu.co.jp/common/pdf/n_catalog_partition07_en.pdf; Supplier Part Number 1: 408-1718-1-ND
R8 R60 = ERJ-P06F3401V: RES 3.4 KOHM 1% 1/2W 0805; Manufacturer: Panasonic; Manufacturer Part Number: ERJP06F3401V; Voltage Rating: 150V; Resistance: 3.4kR; Power Rating: 500mW; Temperature Coefficient: 100ppm/°C; Voltage Rating (DC): 400V; Supplier 1: Digi-Key; Supplier Part Number 1: ERJ-P06F3401V-ND; Stock 1: 0; Pricing 1: 5000=0.0183 (USD); Mount: Surface Mount; Case/Package: 0805; Case Code (Imperial): 0805; Case Code (Metric): 2012; Min Operating Temperature: -55°C; Max Operating Temperature: 155°C; Packaging: Tape and Reel; Package Quantity: 5000; Tolerance: 1%; Composition: Thick Film; Length: 2mm; Height: 0.6mm; Width: 1.2mm; REACH SVHC: No SVHC; ComponentLink1URL: http://www.farnell.com/datasheets/1801181.pdf?src-supplier=Element14; ComponentLink1Description: http://www.farnell.com/datasheets/1801181.pdf?src-supplier=Element14
R11 = RK73H2ATTD2263F: RES 226K OHM 1% 1/4W 0805; Manufacturer: KOA Speer; Resistance: 226kR; Power Rating: 125mW; Voltage Rating: 150V; Temperature Coefficient: 100ppm/°C; Supplier 1: Digi-Key; Supplier Part Number 1: 2019-RK73H2ATTD2263FCT-ND; Manufacturer Part Number: RK73H2ATTD2263F; Stock 1: 3236; Pricing 1: 1=0.1, 10=0.03, 100=0.0124, 1000=0.0056, 2500=0.0048 (USD); Case/Package: 0805; Case Code (Imperial): 0805; Case Code (Metric): 2012; Min Operating Temperature: -55°C; Max Operating Temperature: 155°C; Tolerance: 1%; Packaging: Tape and Reel; Package Quantity: 5000; Termination: SMD/SMT; Voltage Rating (DC): 150V; Series: RK73H; Length: 2mm; Width: 1.25mm; Height: 0.5mm; Lead Free: Lead Free; RoHS Compliant: Yes; ComponentLink1URL: http://www.mouser.com/ds/2/219/RK73H-5715.pdf?src-supplier=Mouser; ComponentLink1Description: http://www.mouser.com/ds/2/219/RK73H-5715.pdf?src-supplier=Mouser; ComponentLink2URL: http://components.arrow.com/part/dataview/39729511S7441442N5146?src-supplier=Arrow+Electronics; ComponentLink2Description: http://components.arrow.com/part/dataview/39729511S7441442N5146?src-supplier=Arrow+Electronics
R12 R68 = RT0805BRD071M17L: RES 1.17M OHM 0.1% 1/8W 0805; Manufacturer: Yageo; Supplier 1: Mouser; Supplier Part Number 1: 603-RT0805BRD071M17L; Manufacturer Part Number: RT0805BRD071M17L; Stock 1: 3176; Pricing 1: 1=0.47, 10=0.276, 50=0.276, 100=0.111, 1000=0.084, 10000=0.063 (USD); RoHS Compliant: Yes
R13 R15 R66 R100 = CRCW0805100RFKEAHP: RES 100 OHM 1% 1/2W 0805; Manufacturer: Vishay Dale; Resistance: 100R; Power Rating: 330mW; Voltage Rating: 150V; Temperature Coefficient: 100ppm/°C; Max Power Dissipation: 500mW; Supplier 1: Digi-Key; Supplier Part Number 1: 541-100TCT-ND; Manufacturer Part Number: CRCW0805100RFKEAHP; Stock 1: 22730; Pricing 1: 1=0.23, 10=0.193, 100=0.0753, 1000=0.0315, 2500=0.0289 (USD); Mount: Surface Mount; Case/Package: 0805; Weight: 0.000194oz; Case Code (Imperial): 0805; Case Code (Metric): 2012; Contact Plating: Tin; Min Operating Temperature: -55°C; Max Operating Temperature: 155°C; Tolerance: 1%; Packaging: Tape and Reel; Package Quantity: 5000; Termination: SMD/SMT; Resistor Type: Thick Film; Voltage Rating (DC): 150V; Features: Automotive AEC-Q200; Series: CRCW-HP; Number of Terminations: 2; Resistance Tolerance: 1%; Construction: Rectangular; Technology: THICK FILM; Length: 2mm; Width: 1.2mm; Height: 0.5mm; Depth: 1.25mm; Radiation Hardening: No; REACH SVHC: Unknown; Military Standard: Not; Lead Free: Lead Free; RoHS Compliant: Yes; ComponentLink1URL: http://www.farnell.com/datasheets/2884039.pdf?src-supplier=Element14; ComponentLink1Description: http://www.farnell.com/datasheets/2884039.pdf?src-supplier=Element14; ComponentLink2URL: http://www.mouser.com/ds/2/427/crcwhpe3-46056.pdf?src-supplier=Mouser; ComponentLink2Description: http://www.mouser.com/ds/2/427/crcwhpe3-46056.pdf?src-supplier=Mouser; ComponentLink3URL: http://www.vishay.com/docs/20043/crcwhpe3.pdf?src-supplier=Avnet; ComponentLink3Description: http://www.vishay.com/docs/20043/crcwhpe3.pdf?src-supplier=Avnet
R14 R31 R37 R43 R44 R65 R70 R74 R82 R84 R99 R104 = ERJ-P06F1002V: RES 10K OHM 1% 1/2W 0805; Manufacturer: Panasonic; Resistance: 10kR; Temperature Coefficient: 100ppm/°C; Power Rating: 500mW; Voltage Rating: 150V; Supplier 1: Digi-Key; Supplier Part Number 1: P16059CT-ND; Manufacturer Part Number: ERJ-P06F1002V; Stock 1: 38689; Pricing 1: 1=0.16, 10=0.134, 100=0.0525, 1000=0.022, 2500=0.0201 (USD); Mount: Surface Mount; Case/Package: 0805; Contact Plating: Tin; Case Code (Imperial): 0805; Case Code (Metric): 2012; Min Operating Temperature: -55°C; Max Operating Temperature: 155°C; Tolerance: 1%; Resistor Type: Thick Film; Packaging: Tape and Reel; Package Quantity: 5000; Termination: SMD/SMT; Voltage Rating (DC): 150V; Features: Automotive AEC-Q200; Series: ERJ; Max Power Dissipation: 500mW; Number of Terminations: 2; Resistance Tolerance: 1%; Technology: THICK FILM; Construction: Rectangular; Length: 2mm; Width: 1.2mm; Height: 0.6mm; Depth: 1.25mm; Radiation Hardening: No; REACH SVHC: No SVHC; Military Standard: Not; Lead Free: Lead Free; RoHS Compliant: Yes; ComponentLink1URL: http://uk.rs-online.com/webdocs/12cb/0900766b812cb812.pdf?src-supplier=RSComponents; ComponentLink1Description: http://uk.rs-online.com/webdocs/12cb/0900766b812cb812.pdf?src-supplier=RSComponents; ComponentLink2URL: http://www.mouser.com/ds/2/315/AOA0000CE4-64075.pdf?src-supplier=Mouser; ComponentLink2Description: http://www.mouser.com/ds/2/315/AOA0000CE4-64075.pdf?src-supplier=Mouser; ComponentLink3URL: https://industrial.panasonic.com/ww/system/files/data/download/catalog/id_fixed-resistors_e_1.pdf?src-supplier=Distrelec; ComponentLink3Description: https://industrial.panasonic.com/ww/system/files/data/download/catalog/id_fixed-resistors_e_1.pdf?src-supplier=Distrelec
R16 R23-R26 R36 R38 R39 R45 R46 R69 R83 R118 R119 = CRCW0805100KFKEAHP: RES 100K OHM 1% 1/2W 0805; Manufacturer: Vishay; Resistance: 100kR; Power Rating: 330mW; Voltage Rating: 150V; Max Power Dissipation: 500mW; Temperature Coefficient: 100ppm/°C; Supplier 1: Digi-Key; Supplier Part Number 1: 541-100KTCT-ND; Manufacturer Part Number: CRCW0805100KFKEAHP; Stock 1: 7831; Pricing 1: 1=0.23, 10=0.193, 100=0.0753, 1000=0.0315, 2500=0.0289 (USD); Mount: Surface Mount; Case/Package: 0805; Weight: 0.000194oz; Case Code (Metric): 2012; Case Code (Imperial): 0805; Contact Plating: Tin; Min Operating Temperature: -55°C; Max Operating Temperature: 155°C; Package Quantity: 10; Tolerance: 1%; Packaging: Tape and Reel; Resistor Type: Thick Film; Number of Terminations: 2; Termination: SMD/SMT; Voltage Rating (DC): 150V; Features: Automotive AEC-Q200; Series: CRCW-HP; Resistance Tolerance: 1%; Construction: Rectangular; Technology: THICK FILM; Length: 2mm; Width: 0.049inch; Height: 0.024inch; Depth: 1.25mm; Radiation Hardening: No; REACH SVHC: Unknown; Military Standard: Not; Lead Free: Lead Free; RoHS Compliant: Yes; ComponentLink1URL: http://www.vishay.com/docs/20043/crcwhpe3.pdf?src-supplier=Digi-Key; ComponentLink1Description: http://www.vishay.com/docs/20043/crcwhpe3.pdf?src-supplier=Digi-Key; ComponentLink2URL: http://www.farnell.com/datasheets/2140397.pdf?src-supplier=Element14; ComponentLink2Description: http://www.farnell.com/datasheets/2140397.pdf?src-supplier=Element14; ComponentLink3URL: http://www.vishay.com/docs/20043/crcwhpe3.pdf?src-supplier=Avnet; ComponentLink3Description: http://www.vishay.com/docs/20043/crcwhpe3.pdf?src-supplier=Avnet
R17 R76 = CRCW08050000Z0EAHP: RES 0 OHM JUMPER 1/2W 0805; Manufacturer: Vishay Dale; Resistance: 0R; Tolerance: 5%; Power Rating: 330mW; Voltage Rating: 150V; Max Power Dissipation: 500mW; Temperature Coefficient: 0ppm/°C; Supplier 1: Digi-Key; Supplier Part Number 1: 541-0.0TBCT-ND; Manufacturer Part Number: CRCW08050000Z0EAHP; Stock 1: 136611; Pricing 1: 1=0.21, 10=0.176, 25=0.128, 50=0.0928, 100=0.0688, 250=0.0528, 500=0.0416, 1000=0.0288 (USD); Mount: Surface Mount; Case/Package: 0805; Number of Pins: 2; Contact Plating: Tin; Weight: 0.000194oz; Case Code (Metric): 2012; Case Code (Imperial): 0805; Size Code: 0805; Min Operating Temperature: -55°C; Max Operating Temperature: 155°C; Resistor Type: Thick Film; Packaging: Tape and Reel; Package Quantity: 5000; Number of Terminations: 2; Termination: Solder; Voltage Rating (DC): 150V; Features: Automotive AEC-Q200; Series: CRCW-HP; Construction: Rectangular; Technology: THICK FILM; Length: 2mm; Width: 0.049inch; Height: 0.024inch; Depth: 1.25mm; Radiation Hardening: No; REACH SVHC: No SVHC; Military Standard: Not; Lead Free: Lead Free; RoHS Compliant: Yes; ComponentLink1URL: http://www.vishay.com/docs/20043/crcwhpe3.pdf?src-supplier=Future+Electronics; ComponentLink1Description: http://www.vishay.com/docs/20043/crcwhpe3.pdf?src-supplier=Future+Electronics; ComponentLink2URL: http://www.vishay.com/docs/20043/crcwhpe3.pdf?src-supplier=Digi-Key; ComponentLink2Description: http://www.vishay.com/docs/20043/crcwhpe3.pdf?src-supplier=Digi-Key; ComponentLink3URL: http://www.mouser.com/ds/2/427/crcwhpe3-46056.pdf?src-supplier=Mouser; ComponentLink3Description: http://www.mouser.com/ds/2/427/crcwhpe3-46056.pdf?src-supplier=Mouser; ComponentLink4URL: http://www.vishay.com/docs/20043/crcwhpe3.pdf?src-supplier=Avnet+Europe; ComponentLink4Description: http://www.vishay.com/docs/20043/crcwhpe3.pdf?src-supplier=Avnet+Europe; ComponentLink5URL: http://www.vishay.com/docs/20043/crcwhpe3.pdf?src-supplier=Avnet; ComponentLink5Description: http://www.vishay.com/docs/20043/crcwhpe3.pdf?src-supplier=Avnet; ComponentLink6URL: http://www.farnell.com/datasheets/2046716.pdf?src-supplier=Element14; ComponentLink6Description: http://www.farnell.com/datasheets/2046716.pdf?src-supplier=Element14
R18 R77 = CRCW08052K00FKEAHP: RES 2K OHM 1% 1/2W 0805; Manufacturer: Vishay Dale; Resistance: 2kR; Power Rating: 330mW; Voltage Rating: 150V; Temperature Coefficient: 100ppm/°C; Max Power Dissipation: 500mW; Supplier 1: Digi-Key; Supplier Part Number 1: 541-2.00KTCT-ND; Manufacturer Part Number: CRCW08052K00FKEAHP; Stock 1: 100922; Pricing 1: 1=0.23, 10=0.193, 100=0.0753, 1000=0.0315, 2500=0.0289 (USD); Mount: Surface Mount; Case/Package: 0805; Weight: 0.000194oz; Case Code (Imperial): 0805; Case Code (Metric): 2012; Contact Plating: Tin; Size Code: 0805; Min Operating Temperature: -55°C; Max Operating Temperature: 155°C; Tolerance: 1%; Packaging: Tape and Reel; Package Quantity: 5000; Resistor Type: Thick Film; Termination: SMD/SMT; Features: Automotive AEC-Q200; Series: CRCW-HP; Number of Terminations: 2; Construction: Rectangular; Technology: THICK FILM; Length: 2mm; Width: 1.2mm; Height: 0.5mm; Depth: 1.25mm; Radiation Hardening: No; Military Standard: Not; Lead Free: Lead Free; RoHS Compliant: Yes; ComponentLink1URL: http://www.vishay.com/docs/20043/crcwhpe3.pdf?src-supplier=Avnet; ComponentLink1Description: http://www.vishay.com/docs/20043/crcwhpe3.pdf?src-supplier=Avnet; ComponentLink2URL: http://www.mouser.com/ds/2/427/crcwhpe3-46056.pdf?src-supplier=Mouser; ComponentLink2Description: http://www.mouser.com/ds/2/427/crcwhpe3-46056.pdf?src-supplier=Mouser
R19 R71 R101 = ERJ-P06F1071V: RES 1.07 KOHM 1% 1/2W 0805; Manufacturer: Panasonic; Manufacturer Part Number: ERJP06F1071V; Resistance: 1.07kR; Power Rating: 500mW; Voltage Rating: 150V; Temperature Coefficient: 100ppm/°C; Voltage Rating (DC): 400V; Supplier 1: Mouser; Supplier Part Number 1: 667-ERJ-P06F1071V; Stock 1: 8690; Pricing 1: 1=0.28, 10=0.112, 100=0.047, 1000=0.035, 5000=0.019, 10000=0.019 (USD); Mount: Surface Mount; Case/Package: 0805; Case Code (Imperial): 0805; Case Code (Metric): 2012; Min Operating Temperature: -55°C; Max Operating Temperature: 155°C; Tolerance: 1%; Packaging: Tape and Reel; Package Quantity: 5000; Composition: Thick Film; Length: 2mm; Height: 0.6mm; Width: 1.2mm; REACH SVHC: No SVHC; ComponentLink1URL: http://www.farnell.com/datasheets/1801181.pdf?src-supplier=Element14; ComponentLink1Description: http://www.farnell.com/datasheets/1801181.pdf?src-supplier=Element14
R20-R22 R27-R30 R33 R35 R40 R49 R50 R53 R54 R73 R75 R79-R81 R93 R102 R106 R109 R110 R127 R128 = CRCW08051K00FKEAHP: RES 1K OHM 1% 1/2W 0805; Manufacturer: Vishay Dale; Resistance: 1kR; Temperature Coefficient: 100ppm/°C; Power Rating: 330mW; Voltage Rating: 150V; Max Power Dissipation: 500mW; Supplier 1: Digi-Key; Supplier Part Number 1: 541-1.00KTCT-ND; Manufacturer Part Number: CRCW08051K00FKEAHP; Stock 1: 393; Pricing 1: 1=0.23, 10=0.193, 100=0.0753, 1000=0.0315, 2500=0.0289 (USD); Mount: Surface Mount; Case/Package: 0805; Number of Pins: 2; Contact Plating: Tin; Weight: 0.000194oz; Case Code (Imperial): 0805; Case Code (Metric): 2012; Min Operating Temperature: -55°C; Max Operating Temperature: 155°C; Tolerance: 1%; Resistor Type: Thick Film; Packaging: Tape and Reel; Package Quantity: 5000; Termination: Solder; Voltage Rating (DC): 150V; Features: Automotive AEC-Q200; Series: CRCW-HP; Number of Terminations: 2; Resistance Tolerance: 1%; Construction: Rectangular; Technology: THICK FILM; Length: 2mm; Width: 1.2mm; Height: 0.5mm; Depth: 1.25mm; Radiation Hardening: No; REACH SVHC: Unknown; Military Standard: Not; Lead Free: Lead Free; RoHS Compliant: Yes; ComponentLink1URL: http://www.farnell.com/datasheets/2046716.pdf?src-supplier=Element14; ComponentLink1Description: http://www.farnell.com/datasheets/2046716.pdf?src-supplier=Element14; ComponentLink2URL: http://www.vishay.com/docs/20043/crcwhpe3.pdf?src-supplier=Avnet; ComponentLink2Description: http://www.vishay.com/docs/20043/crcwhpe3.pdf?src-supplier=Avnet; ComponentLink3URL: http://www.mouser.com/ds/2/427/crcwhpe3-46056.pdf?src-supplier=Mouser; ComponentLink3Description: http://www.mouser.com/ds/2/427/crcwhpe3-46056.pdf?src-supplier=Mouser
R32 R34 R47 R78 R85 R86 R105 R114 R115 R124-R126 R129 R130 = ERJ-P06F4701V: RES 4.7K OHM 1% 1/2W 0805; Manufacturer: Panasonic Electronic Components; Power (Watts): 0.5W, 1/2W; Temperature Coefficient: ±100ppm/°C; Supplier 1: Digi-Key; Manufacturer Part Number: ERJ-P06F4701V; RoHS: RoHS Compliant; Category: Resistors; Stock 1: 38687; Pricing 1: 1=0.19, 10=0.159, 100=0.0622, 1000=0.02604, 2500=0.02386 (USD); Packaging: Cut Tape (CT); Part Status: Active; Tolerance: ±1%; Composition: Thick Film; Features: Automotive AEC-Q200, Pulse Withstanding; Operating Temperature: -55°C ~ 155°C; Package / Case: 0805 (2012 Metric); Supplier Device Package: 0805; Size / Dimension: 0.079" L x 0.049" W (2.00mm x 1.25mm); Height - Seated (Max): 0.028" (0.70mm); Failure Rate: -; ComponentLink1URL: https://industrial.panasonic.com/cdbs/www-data/pdf/RDO0000/AOA0000C331.pdf; ComponentLink1Description: https://industrial.panasonic.com/cdbs/www-data/pdf/RDO0000/AOA0000C331.pdf; Supplier Part Number 1: P16073CT-ND
R41 R42 = HCJ0805ZT0R00: RES SMD 0 OHM JUMPER 0805; Manufacturer: Stackpole Electronics Inc.; Power (Watts): 0.5W, 1/2W; Supplier 1: Digi-Key; Manufacturer Part Number: HCJ0805ZT0R00; RoHS: RoHS Compliant; Category: Resistors; Stock 1: 4; Pricing 1: 1=0.59, 10=0.455, 25=0.3464, 50=0.2574, 100=0.1914, 250=0.16172, 500=0.1386, 1000=0.1056 (USD); Packaging: Cut Tape (CT); Part Status: Active; Tolerance: Jumper; Composition: Metal Foil; Features: Automotive AEC-Q200; Temperature Coefficient: -; Operating Temperature: -55°C ~ 155°C; Package / Case: 0805 (2012 Metric); Supplier Device Package: 0805; Size / Dimension: 0.079" L x 0.049" W (2.00mm x 1.25mm); Height - Seated (Max): 0.032" (0.80mm); Failure Rate: -; ComponentLink1URL: https://www.seielect.com/catalog/SEI-HCJ.pdf; ComponentLink1Description: https://www.seielect.com/catalog/SEI-HCJ.pdf; Supplier Part Number 1: HCJ0805ZT0R00CT-ND